# Altium project Artificial_skin.PrjPcb
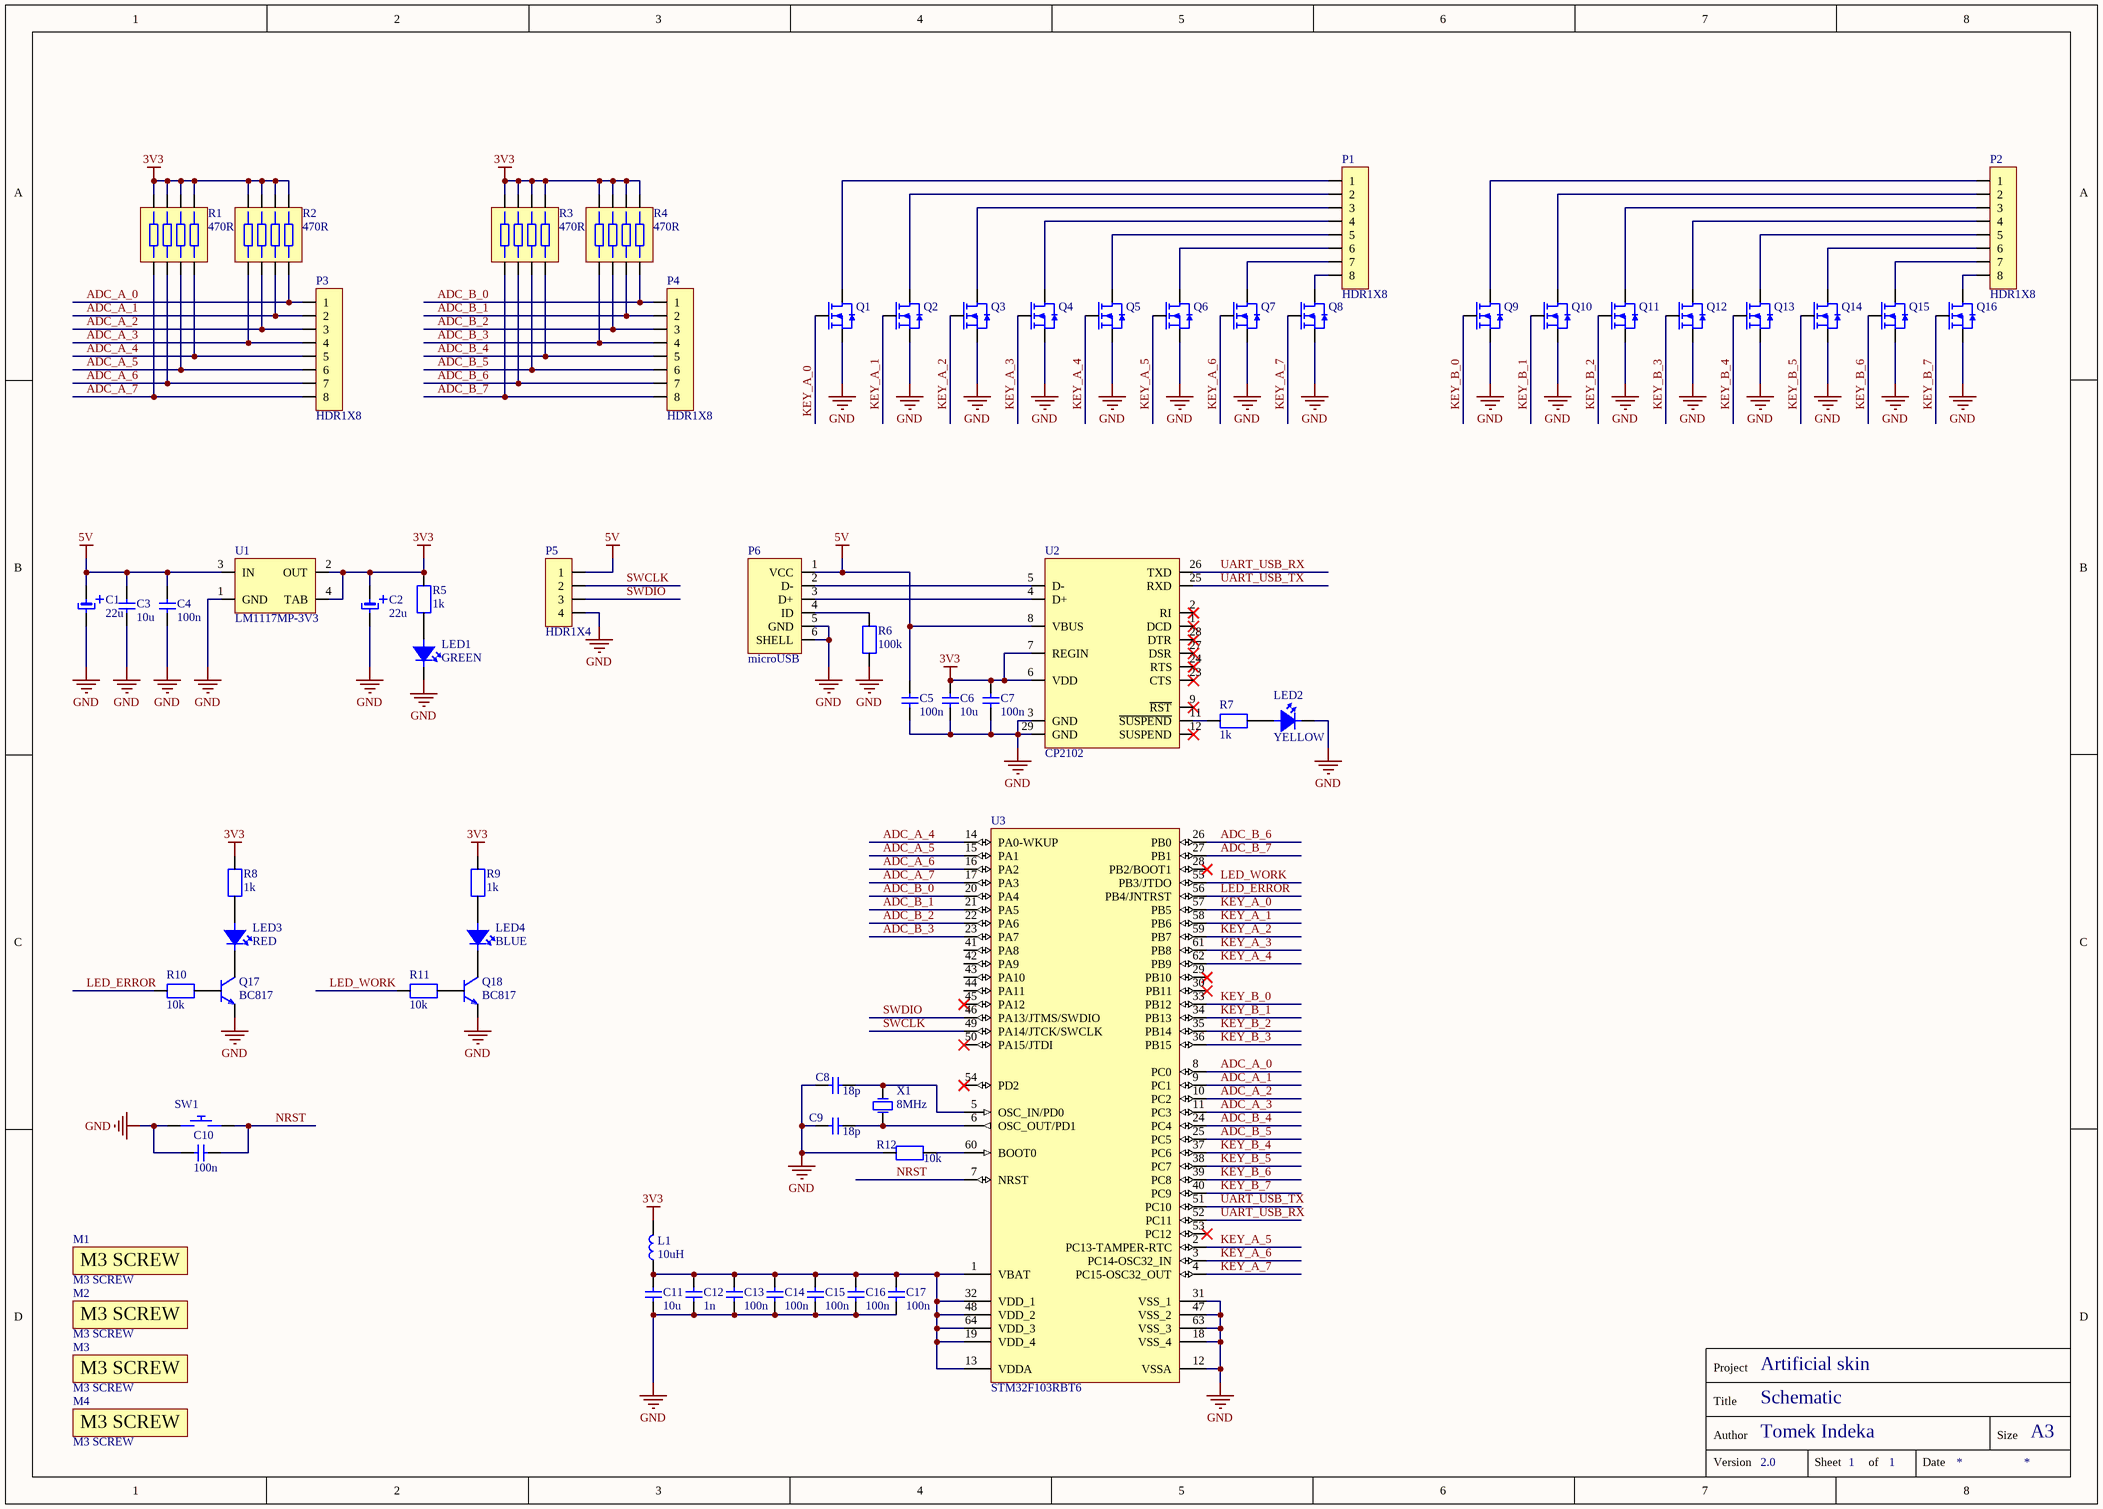
[diagram p0: Artificial_skin_schematic.SchDoc]
ProVersion: 2.0; ProProjectName: Artificial skin; ProAuthor: Tomek Indeka
1 sheet, 67 parts. Net scope: global (net labels, ports and power ports of the same name join across sheets).
Board file: Artificial_skin_layout.PcbDoc

## Sheet Artificial_skin_schematic.SchDoc
size A3; DocumentNumber: 1; SheetNumber: 1; SheetTotal: 1; DocDocumentName: Schematic

### Parts
C1  22u  [C_POL_THT_FI4]
C2  22u  [C_POL_THT_FI4]
C3  10u  [C_0805]
C4  100n  [C_0603]
C5  100n  [C_0603]
C6  10u  [C_0805]
C7  100n  [C_0603]
C8  18p  [C_0603]
C9  18p  [C_0603]
C10  100n  [C_0603]
C11  10u  [C_0805]
C12  1n  [C_0603]
C13  100n  [C_0603]
C14  100n  [C_0603]
C15  100n  [C_0603]
C16  100n  [C_0603]
C17  100n  [C_0603]
L1  10uH  [L_0603]
LED1  GREEN  [D_LED_0603]
LED2  YELLOW  [D_LED_0603]
LED3  RED  [D_LED_0603]
LED4  BLUE  [D_LED_0603]
M1  M3 SCREW  [M_M3_SCREW]
M2  M3 SCREW  [M_M3_SCREW]
M3  M3 SCREW  [M_M3_SCREW]
M4  M3 SCREW  [M_M3_SCREW]
P1  HDR1X8  [P_JST_2.0_1x8]
P2  HDR1X8  [P_JST_2.0_1x8]
P3  HDR1X8  [P_JST_2.0_1x8]
P4  HDR1X8  [P_JST_2.0_1x8]
P5  HDR1X4  [P_MOLEX_2.5_1x4]
P6  microUSB  [P_USB_micro_v3]
Q1  BSS806N  [U_SOT-23]  (value not drawn)
Q2  BSS806N  [U_SOT-23]  (value not drawn)
Q3  BSS806N  [U_SOT-23]  (value not drawn)
Q4  BSS806N  [U_SOT-23]  (value not drawn)
Q5  BSS806N  [U_SOT-23]  (value not drawn)
Q6  BSS806N  [U_SOT-23]  (value not drawn)
Q7  BSS806N  [U_SOT-23]  (value not drawn)
Q8  BSS806N  [U_SOT-23]  (value not drawn)
Q9  BSS806N  [U_SOT-23]  (value not drawn)
Q10  BSS806N  [U_SOT-23]  (value not drawn)
Q11  BSS806N  [U_SOT-23]  (value not drawn)
Q12  BSS806N  [U_SOT-23]  (value not drawn)
Q13  BSS806N  [U_SOT-23]  (value not drawn)
Q14  BSS806N  [U_SOT-23]  (value not drawn)
Q15  BSS806N  [U_SOT-23]  (value not drawn)
Q16  BSS806N  [U_SOT-23]  (value not drawn)
Q17  BC817  [U_SOT-23]
Q18  BC817  [U_SOT-23]
R1  470R  [R_ARR_4_1206]
R2  470R  [R_ARR_4_1206]
R3  470R  [R_ARR_4_1206]
R4  470R  [R_ARR_4_1206]
R5  1k  [R_0603]
R6  100k  [R_0603]
R7  1k  [R_0603]
R8  1k  [R_0603]
R9  1k  [R_0603]
R10  10k  [R_0603]
R11  10k  [R_0603]
R12  10k  [R_0603]
SW1  Micro Switch  [SW_Tact_34N-F]  (value not drawn)
U1  LM1117MP-3V3  [U_SOT-223]
U2  CP2102  [U_QFN_28_5mm]
U3  STM32F103RBT6  [U_LQFP-64]
X1  8MHz  [X_HC49-4H-THT]

### Nets
3V3: C2.1 C6.1 C7.1 L1.2 R1.5 R1.6 R1.7 R1.8 R2.5 R2.6 R2.7 R2.8 R3.5 R3.6 R3.7 R3.8 R4.5 R4.6 R4.7 R4.8 R5.2 R8.2 R9.2 U1.2(OUT) U1.4(TAB) U2.6(VDD) U2.7(REGIN)
5V: C1.1 C3.1 C4.1 C5.1 P5.1 P6.1(VCC) U1.3(IN) U2.8(VBUS)
GND: C1.2 C2.2 C3.2 C4.2 C5.2 C6.2 C7.2 C8.1 C9.1 C10.2 C11.2 C12.2 C13.2 C14.2 C15.2 C16.2 C17.2 LED1.2(K) LED2.2(K) P5.4 P6.5(GND) P6.6(SHELL) Q1.2(S) Q2.2(S) Q3.2(S) Q4.2(S) Q5.2(S) Q6.2(S) Q7.2(S) Q8.2(S) Q9.2(S) Q10.2(S) Q11.2(S) Q12.2(S) Q13.2(S) Q14.2(S) Q15.2(S) Q16.2(S) Q17.E Q18.E R6.1 R12.1 SW1.2 U1.1(GND) U2.3(GND) U2.29(GND) U3.12(VSSA) U3.18(VSS_4) U3.31(VSS_1) U3.47(VSS_2) U3.63(VSS_3)
ADC_A_0: P3.1 R2.4 U3.8(PC0)
ADC_A_1: P3.2 R2.3 U3.9(PC1)
ADC_A_2: P3.3 R2.2 U3.10(PC2)
ADC_A_3: P3.4 R2.1 U3.11(PC3)
ADC_A_4: P3.5 R1.4 U3.14(PA0-WKUP)
ADC_A_5: P3.6 R1.3 U3.15(PA1)
ADC_A_6: P3.7 R1.2 U3.16(PA2)
ADC_A_7: P3.8 R1.1 U3.17(PA3)
ADC_B_0: P4.1 R4.4 U3.20(PA4)
ADC_B_1: P4.2 R4.3 U3.21(PA5)
ADC_B_2: P4.3 R4.2 U3.22(PA6)
ADC_B_3: P4.4 R4.1 U3.23(PA7)
ADC_B_4: P4.5 R3.4 U3.24(PC4)
ADC_B_5: P4.6 R3.3 U3.25(PC5)
ADC_B_6: P4.7 R3.2 U3.26(PB0)
ADC_B_7: P4.8 R3.1 U3.27(PB1)
KEY_A_0: Q1.1(G) U3.57(PB5)
KEY_A_1: Q2.1(G) U3.58(PB6)
KEY_A_2: Q3.1(G) U3.59(PB7)
KEY_A_3: Q4.1(G) U3.61(PB8)
KEY_A_4: Q5.1(G) U3.62(PB9)
KEY_A_5: Q6.1(G) U3.2(PC13-TAMPER-RTC)
KEY_A_6: Q7.1(G) U3.3(PC14-OSC32_IN)
KEY_A_7: Q8.1(G) U3.4(PC15-OSC32_OUT)
KEY_B_0: Q9.1(G) U3.33(PB12)
KEY_B_1: Q10.1(G) U3.34(PB13)
KEY_B_2: Q11.1(G) U3.35(PB14)
KEY_B_3: Q12.1(G) U3.36(PB15)
KEY_B_4: Q13.1(G) U3.37(PC6)
KEY_B_5: Q14.1(G) U3.38(PC7)
KEY_B_6: Q15.1(G) U3.39(PC8)
KEY_B_7: Q16.1(G) U3.40(PC9)
LED_ERROR: R10.1 U3.56(PB4/JNTRST)
LED_WORK: R11.1 U3.55(PB3/JTDO)
NRST: C10.1 SW1.1 U3.7(NRST)
SWCLK: P5.2 U3.49(PA14/JTCK/SWCLK)
SWDIO: P5.3 U3.46(PA13/JTMS/SWDIO)
UART_USB_RX: U2.26(TXD) U3.52(PC11)
UART_USB_TX: U2.25(RXD) U3.51(PC10)
NetC8_2: C8.2 U3.5(OSC_IN/PD0) X1.2(OSC2)
NetC9_2: C9.2 U3.6(OSC_OUT/PD1) X1.1(OSC1)
NetC11_1: C11.1 C12.1 C13.1 C14.1 C15.1 C16.1 C17.1 L1.1 U3.1(VBAT) U3.13(VDDA) U3.19(VDD_4) U3.32(VDD_1) U3.48(VDD_2) U3.64(VDD_3)
NetLED1_1: LED1.1(A) R5.1
NetLED2_1: LED2.1(A) R7.1
NetLED3_1: LED3.1(A) R8.1
NetLED3_2: LED3.2(K) Q17.C
NetLED4_1: LED4.1(A) R9.1
NetLED4_2: LED4.2(K) Q18.C
NetP1_1: P1.1 Q1.3(D)
NetP1_2: P1.2 Q2.3(D)
NetP1_3: P1.3 Q3.3(D)
NetP1_4: P1.4 Q4.3(D)
NetP1_5: P1.5 Q5.3(D)
NetP1_6: P1.6 Q6.3(D)
NetP1_7: P1.7 Q7.3(D)
NetP1_8: P1.8 Q8.3(D)
NetP2_1: P2.1 Q9.3(D)
NetP2_2: P2.2 Q10.3(D)
NetP2_3: P2.3 Q11.3(D)
NetP2_4: P2.4 Q12.3(D)
NetP2_5: P2.5 Q13.3(D)
NetP2_6: P2.6 Q14.3(D)
NetP2_7: P2.7 Q15.3(D)
NetP2_8: P2.8 Q16.3(D)
NetP6_2: P6.2(D-) U2.5(D-)
NetP6_3: P6.3(D+) U2.4(D+)
NetP6_4: P6.4(ID) R6.2
NetQ17_B: Q17.B R10.2
NetQ18_B: Q18.B R11.2
NetR7_2: R7.2 U2.11(~{SUSPEND})
NetR12_2: R12.2 U3.60(BOOT0)

Not connected (* = marked no-connect by the designer): U2 1(DCD)* 2(RI)* 9(~{RST})* 10(NC) 12(SUSPEND)* 13(NC) 14(NC) 15(NC) 16(NC) 17(NC) 18(NC) 19(NC) 20(NC) 21(NC) 22(NC) 23(CTS)* 24(RTS)* 27(DSR)* 28(DTR)*; U3 28(PB2/BOOT1)* 29(PB10)* 30(PB11)* 41(PA8) 42(PA9) 43(PA10) 44(PA11) 45(PA12)* 50(PA15/JTDI)* 53(PC12)* 54(PD2)*

### Notes on the sheet
- Project
- Title
- Author
- Size
- A3
- Version
- Sheet
- of
- Date

### Library data of the parts
C1 C2 = C_POL_THT: Electrolytic capacitor; PartAssemblyNote: 22u, N/S; Assembly: THT; Voltage Rating: N/S; Pins: 2; Category: Capacitors - Polar; PartNumber: *; Capacitance: 22u
C3 C6 C11 = C_SMT: Ceramic capacitor; PartAssemblyNote: 10u, N/S, N/S; Assembly: SMT; Dielectric: N/S; Pins: 2; Category: Capacitors - Ceramic; PartNumber: =PartAssemblyNote; Voltage Rating: N/S; Capacitance: 10u
C4 C5 C7 C12-C17 = C_CAP: Capacitor; Assembly: SMT; Voltage Rating: 25V; Pins: 2; Category: Ceramic Capacitors
  C4 C5 C7 C13-C17: PartAssemblyNote: 100n
  C12: PartAssemblyNote: 1n
C8-C10 = C_CAP: Capacitor; Assembly: SMT; Pins: 2; Category: Ceramic Capacitors
  C8 C9: PartAssemblyNote: 18p
  C10: PartAssemblyNote: 100n
L1 = L_Coil: Inductor; Assembly: SMT; Pins: 2; Category: Inductors; PartAssemblyNote: 10uH
LED1-LED4 = D_LED: LED; Assembly: SMT; Pins: 2; Category: LEDs
  LED1: PartAssemblyNote: GREEN
  LED2: PartAssemblyNote: YELLOW
  LED3: PartAssemblyNote: RED
  LED4: PartAssemblyNote: BLUE
M1-M4 = M_M3_SCREW: Śruba M3 do mocowania PCB; Assembly: MMT; Category: Screws; PartAssemblyNote: M3 SCREW; Pins: 0
P1-P4 = P_HDR1X8: Header, 8-Pin; PartAssemblyNote: JST 2.0mm 8pin; Assembly: THT; Category: Connectors; Pins: 8
P5 = P_HDR1X4: Header, 4-Pin; PartAssemblyNote: Molex 2.5mm 4 pin; Assembly: THT; Category: Connectors; Pins: 4
P6 = P_USB_micro: Manufacturer: *; Category: *; PartAssemblyNote: microUSB; Aseembly: *; Pins: *
Q1-Q16 = Q_BSS806N: N-MOS OptiMOS™2 Small-Signal-Transistor; Manufacturer: Irfeon; Assembly: SMT; Category: MOSFETs; PartAssemblyNote: BSS806N; Pins: 3; PartNumber: *
Q17 Q18 = Q_BC817: NPN transistor; pin to pad: B>1 C>3 E>2; Assembly: SMT; Pins: 3; Category: BJTs; PartAssemblyNote: BC817
R1-R4 = R_ARR_4: Resistor array; Assembly: SMT; Manufacturer: *; Category: Resistors; PartAssemblyNote: 470R; Pins: 8; PartNumber: *
R5-R12 = R_RES: Resistor; Assembly: SMT; Pins: 2; Category: Resistors
  R5 R7-R9: PartAssemblyNote: 1k
  R6: PartAssemblyNote: 100k
  R10-R12: PartAssemblyNote: 10k
SW1 = SW_MicroSwitch: Micro Switch, pushbutton, monostable; PartAssemblyNote: TACT-34N-F; Assembly: SMT; Category: Pushbutton Switches; Pins: 2
U1 = U_LM1117MP-3V3: 800mA Low-Dropout Linear Regulator; Manufacturer: Texas Instruments; Assembly: SMT; Category: Voltage Regulators - Linear; Pins: 4; PartAssemblyNote: LM1117MP-3V3
U2 = U_CP2102: SINGLE-CHIP USB-TO-UART BRIDGE; Manufacturer: *; Category: *; PartAssemblyNote: CP2102; Aseembly: *; Pins: *
U3 = U_STM32F103RBT6: STM32 ARM-based 32-bit; Manufacturer: STMicroelectronics; Assembly: SMT; Category: Microcontrollers; Pins: 64; PartAssemblyNote: STM32F103RBT6
X1 = X_XTAL: Crystal oscillator; Assembly: *; Pins: 2; Category: Oscillators; PartAssemblyNote: 8MHz; PartNumber: *; Load Capacitance: *